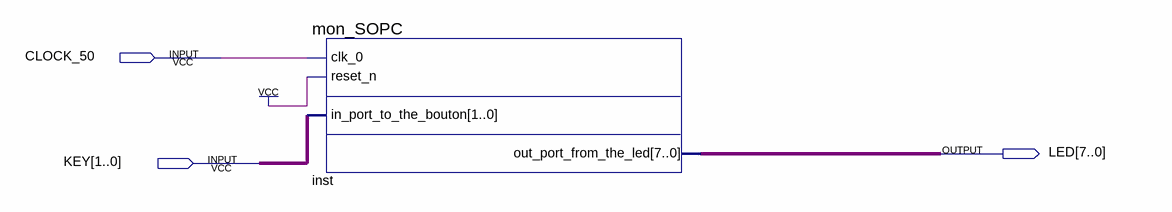
[diagram p0: schematic sheet]
// Quartus schematic SOPC1.bdf as structural Verilog: 1 symbols, 3 pins
module SOPC1 (
  input  CLOCK_50,
  input  [1:0] KEY,
  output [7:0] LED
);

  mon_SOPC inst (.clk_0(CLOCK_50), .reset_n(1'b1), .in_port_to_the_bouton(KEY), .out_port_from_the_led(LED));
endmodule
